# EAGLE design EX-YU_64K_C64_CART (EAGLE 6.3)
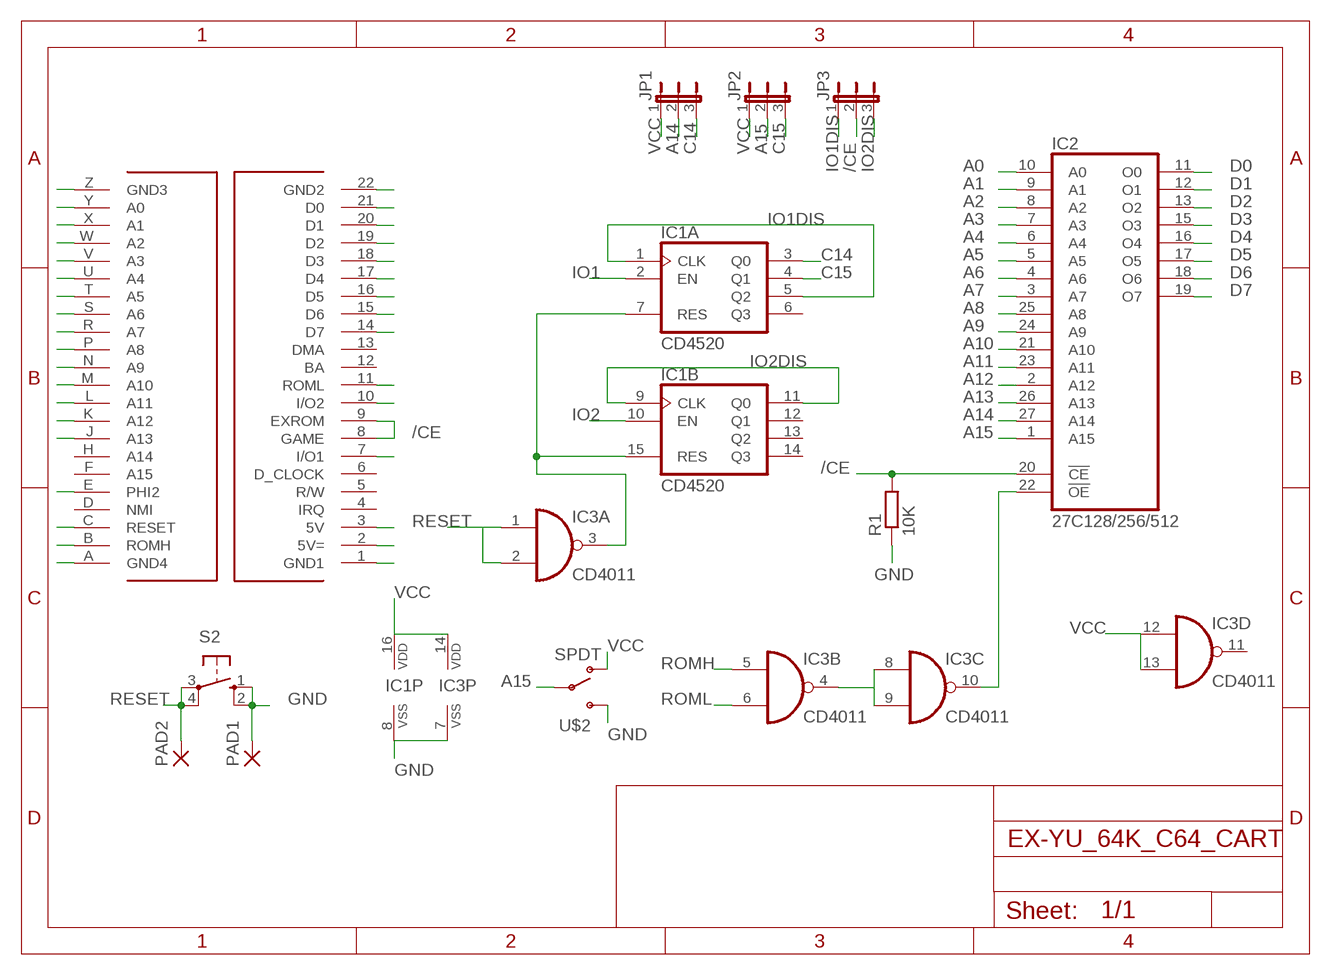
[diagram p0: schematic, sheet 1]

## Parts
IC1  CD4520  4520N  [DIL16]
IC2  27C128/256/512  27512  [DIL28]
IC3  CD4011  4011N  [DIL14]
JP1  JP2E  [JP2]
JP2  JP2E  [JP2]
JP3  JP2E  [JP2]
PAD1  SMD5  [SMD2,54-5,08]
PAD2  SMD5  [SMD2,54-5,08]
R1  10K  R-EU_0207/10  [0207/10]
S2  10-XX  [B3F-10XX]
U$1  C64_EXPANSION__CARTRIDGE  [C64_EXPANSION__CARTRIDGE]
U$2  SPDT  [SPDT-SLIDE]

## Nets
/CE: IC2.20(!CE) JP3.2 R1.2 U$1.8(GAME) U$1.9(EXROM)
A0: IC2.10(A0) U$1.Y(A0)
A1: IC2.9(A1) U$1.X(A1)
A2: IC2.8(A2) U$1.W(A2)
A3: IC2.7(A3) U$1.V(A3)
A4: IC2.6(A4) U$1.U(A4)
A5: IC2.5(A5) U$1.T(A5)
A6: IC2.4(A6) U$1.S(A6)
A7: IC2.3(A7) U$1.R(A7)
A8: IC2.25(A8) U$1.P(A8)
A9: IC2.24(A9) U$1.N(A9)
A10: IC2.21(A10) U$1.M(A10)
A11: IC2.23(A11) U$1.L(A11)
A12: IC2.2(A12) U$1.K(A12)
A13: IC2.26(A13) U$1.J(A13)
A14: IC2.27(A14) JP1.2
A15: IC2.1(A15) JP2.2 U$2.2
C14: IC1.3(A:Q0) JP1.3
C15: IC1.4(A:Q1) JP2.3
D0: IC2.11(O0) U$1.21(D0)
D1: IC2.12(O1) U$1.20(D1)
D2: IC2.13(O2) U$1.19(D2)
D3: IC2.15(O3) U$1.18(D3)
D4: IC2.16(O4) U$1.17(D4)
D5: IC2.17(O5) U$1.16(D5)
D6: IC2.18(O6) U$1.15(D6)
D7: IC2.19(O7) U$1.14(D7)
GND: IC1.8(P:VSS) IC3.7(P:VSS) PAD1.1(P) R1.1 S2.1(S) S2.2(S1) U$1.1(GND1) U$1.22(GND2) U$1.A(GND4) U$1.Z(GND3) U$2.3
IO1: IC1.2(A:EN) U$1.7(I/O1)
IO1DIS: IC1.1(A:CLK) IC1.5(A:Q2) JP3.1
IO2: IC1.10(B:EN) U$1.10(I/O2)
IO2DIS: IC1.9(B:CLK) IC1.11(B:Q0) JP3.3
N$2: IC1.7(A:RES) IC1.15(B:RES) IC3.3(A:O)
N$3: IC3.4(B:O) IC3.8(C:I0) IC3.9(C:I1)
N$4: IC2.22(!OE) IC3.10(C:O)
PHI2: U$1.E(PHI2)
RESET: IC3.1(A:I0) IC3.2(A:I1) PAD2.1(P) S2.3(P) S2.4(P1) U$1.C(RESET)
ROMH: IC3.5(B:I0) U$1.B(ROMH)
ROML: IC3.6(B:I1) U$1.11(ROML)
VCC: IC1.16(P:VDD) IC3.12(D:I0) IC3.13(D:I1) IC3.14(P:VDD) JP1.1 JP2.1 U$1.2(5V=) U$1.3(5V) U$2.1
Unconnected: IC1.6(A:Q3) IC1.12(B:Q1) IC1.13(B:Q2) IC1.14(B:Q3) IC3.11(D:O) U$1.4(IRQ) U$1.5(R/W) U$1.6(D_CLOCK) U$1.12(BA) U$1.13(DMA) U$1.D(NMI) U$1.F(A15) U$1.H(A14)

## Power pins joined to a net without a drawn wire
GND: IC2.14(GND)
VCC: IC2.28(VCC)

## Library data of the parts
IC1 = 45xx:4520: Dual binary up COUNTER
IC2 = memory:27512: MEMORY
IC3 = 40xx:4011: Quad 2-input NAND
JP1-JP3 = jumper:JP2E: JUMPER
PAD1 PAD2 = wirepad:SMD5: SMD PAD
R1 = resistor:R-EU_: RESISTOR, European symbol
S2 = switch-omron:10-XX: OMRON SWITCH; MPN: B3F-1000; OC_FARNELL: 176432; OC_NEWARK: 36M3542
U$1 = 64kb_cart-slim:C64_EXPANSION__CARTRIDGE
U$2 = switches:SPDT

## Board
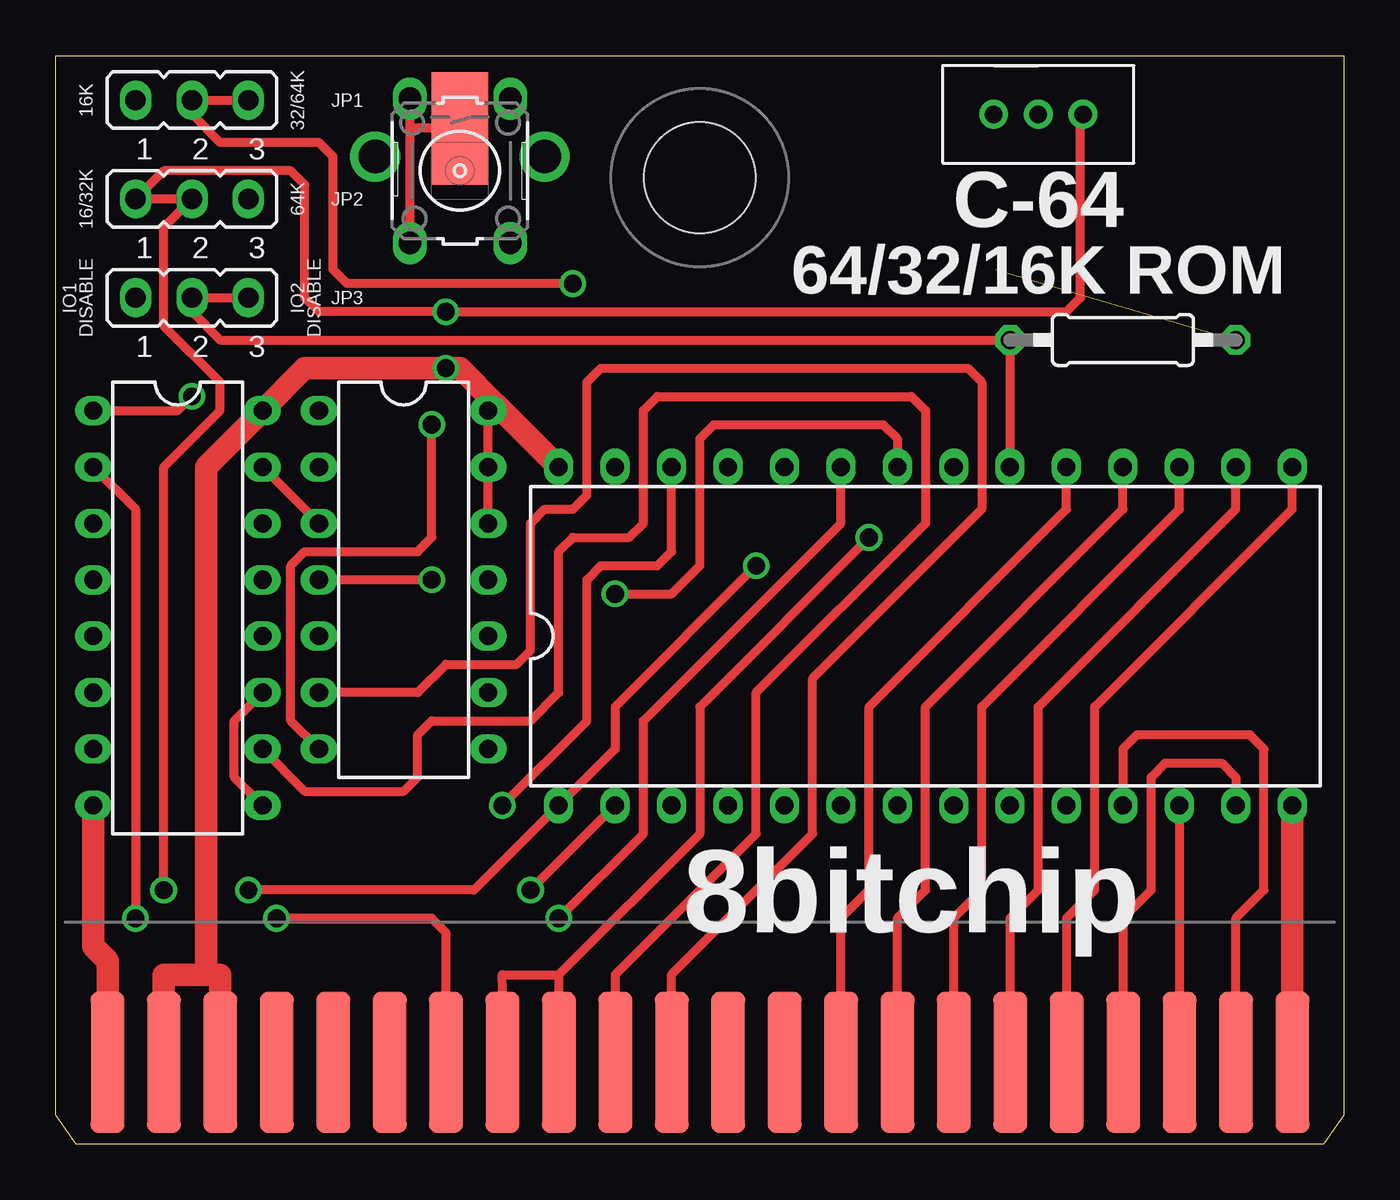
[diagram p1: board, top side]
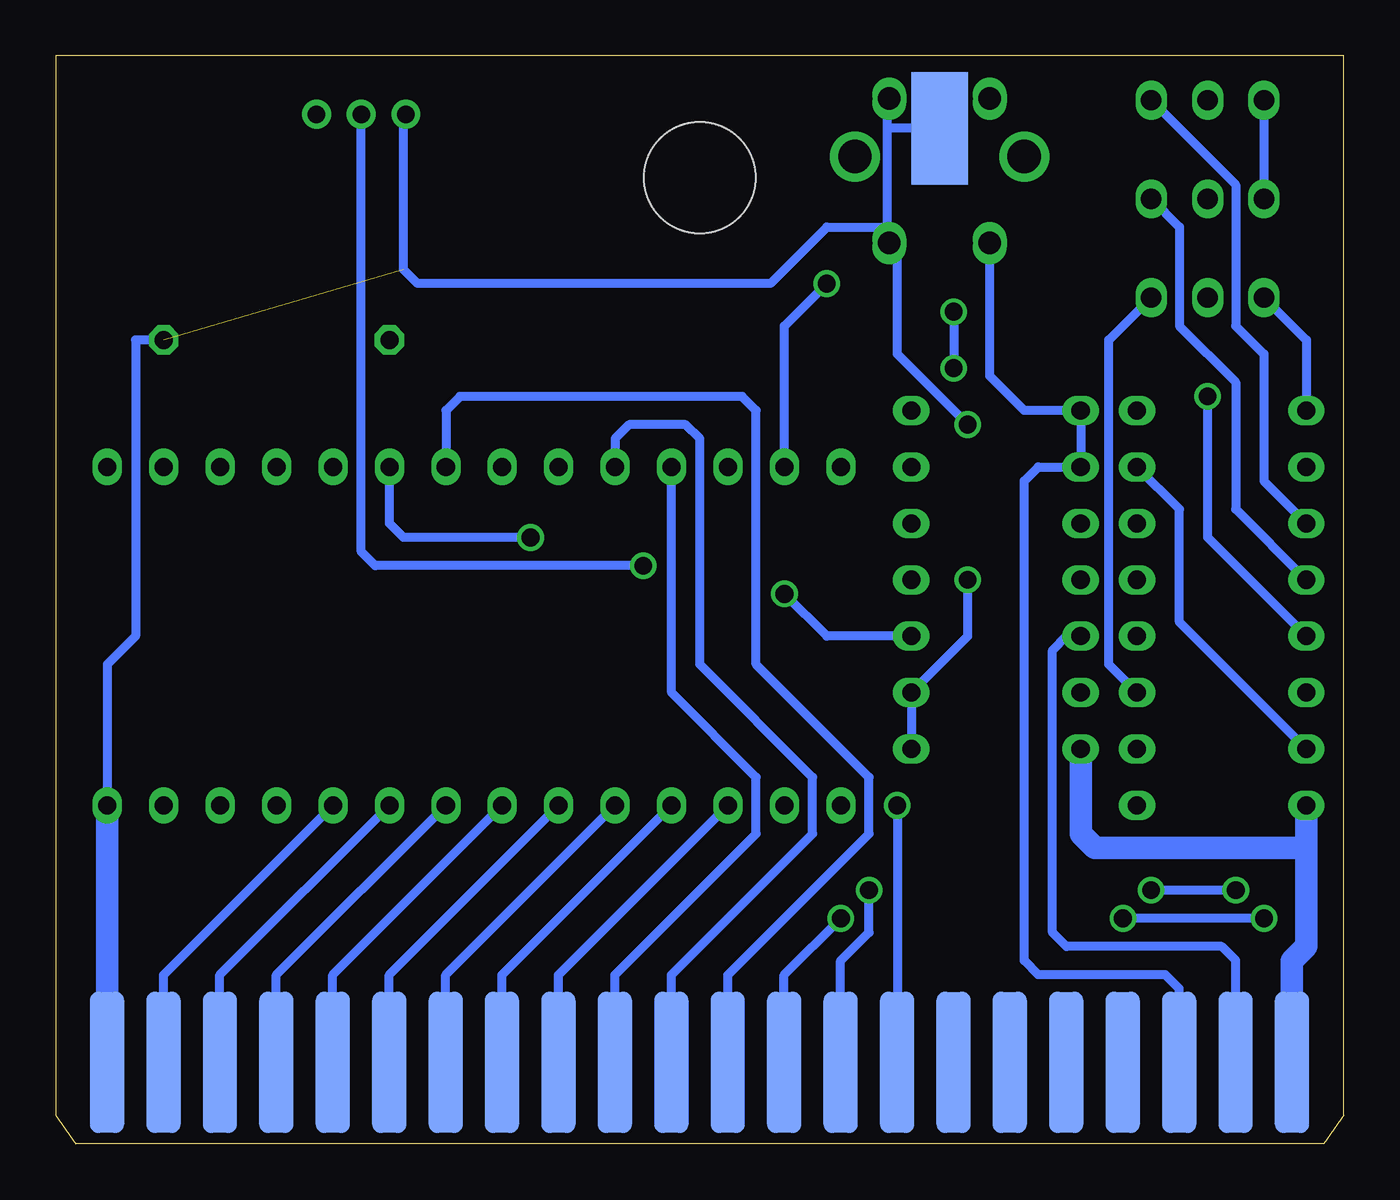
[diagram p2: board, bottom side, seen from below]

Size 58 x 49 mm. Coordinates in mm from the lower left corner, seen from the top.
Copper layers (1*16): Top 0.035mm / dielectric 1.5mm / Bottom 0.035mm
Design rules "dirt_cheap_dirty_boards.v1 *": minimum track width 5mil, minimum drill 12mil, track to track 5mil, track to pad 5mil, pad to pad 5mil, via to via 5mil, smd to smd 0mil, copper to edge 10mil, drill to drill 10mil, minimum pad ring 10mil, minimum via ring 6mil, stop-mask expansion 2mil, vias tented up to drill 25mil, thermal gap 10mil

### Footprints (pad centres in the part's own frame; a part is rotated, then mirrored left to right if it is on the bottom)
DIL16 = drill 0.813 long: 1 -8.89,-3.81; 2 -6.35,-3.81; 3 -3.81,-3.81; 4 -1.27,-3.81; 5 1.27,-3.81; 6 3.81,-3.81; 7 6.35,-3.81; 8 8.89,-3.81; 9 8.89,3.81; 10 6.35,3.81; 11 3.81,3.81; 12 1.27,3.81; 13 -1.27,3.81; 14 -3.81,3.81; 15 -6.35,3.81; 16 -8.89,3.81
DIL28 = drill 0.813 long: 1 -16.51,-7.62; 2 -13.97,-7.62; 3 -11.43,-7.62; 4 -8.89,-7.62; 5 -6.35,-7.62; 6 -3.81,-7.62; 7 -1.27,-7.62; 8 1.27,-7.62; 9 3.81,-7.62; 10 6.35,-7.62; 11 8.89,-7.62; 12 11.43,-7.62; 13 13.97,-7.62; 14 16.51,-7.62; 15 16.51,7.62; 16 13.97,7.62; 17 11.43,7.62; 18 8.89,7.62; 19 6.35,7.62; 20 3.81,7.62; 21 1.27,7.62; 22 -1.27,7.62; 23 -3.81,7.62; 24 -6.35,7.62; 25 -8.89,7.62; 26 -11.43,7.62; 27 -13.97,7.62; 28 -16.51,7.62
DIL14 = drill 0.813 long: 1 -7.62,-3.81; 2 -5.08,-3.81; 3 -2.54,-3.81; 4 0,-3.81; 5 2.54,-3.81; 6 5.08,-3.81; 7 7.62,-3.81; 8 7.62,3.81; 9 5.08,3.81; 10 2.54,3.81; 11 0,3.81; 12 -2.54,3.81; 13 -5.08,3.81; 14 -7.62,3.81
JP2 = drill 0.914 long: 1 -2.54,0; 2 0,0; 3 2.54,0
SMD2,54-5,08 = smd 2.54 x 5.08: 1 0,0
0207/10 = drill 0.813 octagon: 1 -5.08,0; 2 5.08,0
B3F-10XX = drill 1.016 long: 1 -3.251,2.261; 2 3.251,2.261; 3 -3.251,-2.261; 4 3.251,-2.261
C64_EXPANSION__CARTRIDGE = smd 1.524 x 6.35: 1 5.09,3.675; 2 7.63,3.675; 3 10.17,3.675; 4 12.71,3.675; 5 15.25,3.675; 6 17.79,3.675; 7 20.33,3.675; 8 22.87,3.675; 9 25.41,3.675; 10 27.95,3.675; 11 30.49,3.675; 12 33.03,3.675; 13 35.57,3.675; 14 38.11,3.675; 15 40.65,3.675; 16 43.19,3.675; 17 45.73,3.675; 18 48.27,3.675; 19 50.81,3.675; 20 53.35,3.675; 21 55.89,3.675; 22 58.43,3.675 | smd 1.524 x 6.35 bottom: A 5.09,3.675; B 7.63,3.675; C 10.17,3.675; D 12.71,3.675; E 15.25,3.675; F 17.79,3.675; H 20.33,3.675; J 22.87,3.675; K 25.41,3.675; L 27.95,3.675; M 30.49,3.675; N 33.03,3.675; P 35.57,3.675; R 38.11,3.675; S 40.65,3.675; T 43.19,3.675; U 45.73,3.675; V 48.27,3.675; W 50.81,3.675; X 53.35,3.675; Y 55.89,3.675; Z 58.43,3.675 | hole 5: 31.75,43.5
SPDT-SLIDE = drill 0.787: 1 -2.007,0; 2 0,0; 3 2.007,0

### Placement (x,y rotation side)
IC1  5.5,24.13 270 top
IC2  39.16,22.86 0 top
IC3  15.66,25.4 270 top
JP1  6.14,46.99 0 top
JP2  6.14,42.55 0 top
JP3  6.14,38.1 0 top
PAD1  18.2,45.72 0 bottom
PAD2  18.2,45.72 0 top
R1  48.05,36.2 180 top
S2  18.2,43.81 270 top
U$1  -2.75,0 0 top
U$2  44.24,46.35 180 top

### Tracks (layer width: path | path; a pad name or v marks a point on that pad's centre or on a via)
/CE  (via drill 0.8)
  Top 0.406: U$1.8 20.12,6.97 20.11,7.62 22.65,7.62 | 22.65,7.62 22.65,3.69 U$1.9 | v36.62,27.3 29,19.68 29,13.97 22.65,7.62 | IC2.20 R1.2 7.41,36.2 6.14,37.47 JP3.2
  Bottom 0.406: v36.62,27.3 42.34,27.3 42.97,27.94 IC2.20
A0
  Bottom 0.406: U$1.Y 53.14,7.61 IC2.10
A1
  Bottom 0.406: U$1.X 50.6,7.61 IC2.9
A2
  Bottom 0.406: U$1.W 48.06,7.61 IC2.8
A3
  Bottom 0.406: U$1.V 45.52,7.61 IC2.7
A4
  Bottom 0.406: U$1.U 42.98,7.61 IC2.6
A5
  Bottom 0.406: U$1.T 40.44,7.61 IC2.5
A6
  Bottom 0.406: U$1.S 37.9,7.61 IC2.4
A7
  Bottom 0.406: U$1.R 35.36,7.61 IC2.3
A8
  Bottom 0.406: U$1.P 32.82,7.61 26.46,13.97 26.46,16.51 30.27,20.32 IC2.25
A9
  Bottom 0.406: U$1.N 30.28,7.61 23.92,13.97 23.92,16.51 29,21.59 29,31.75 29.63,32.38 32.17,32.38 32.81,31.75 IC2.24
A10
  Bottom 0.406: U$1.M 27.74,7.61 21.38,13.97 21.38,16.51 26.46,21.59 26.46,33.02 27.09,33.66 39.8,33.66 40.43,33.02 IC2.21
A11  (via drill 0.8)
  Top 0.406: v22.65,10.16 26.46,13.97 26.46,19.05 35.35,27.94 IC2.23
  Bottom 0.406: U$1.L 25.2,7.61 v22.65,10.16
A12  (via drill 0.8)
  Top 0.406: IC2.2 v21.38,11.43
  Bottom 0.406: 22.65,3.69 U$1.K 22.66,8.24 21.38,9.53 v21.38,11.43
A13  (via drill 0.8)
  Top 0.406: v20.11,15.24 23.92,19.05 23.92,25.4 24.55,26.04 27.09,26.04 27.73,26.67 IC2.26
  Bottom 0.406: v20.11,15.24 20.11,3.69 U$1.J
A14  (via drill 0.8)
  Top 0.406: v23.29,38.73 13.12,38.73 12.49,39.37 12.49,44.45 11.86,45.09 7.41,45.09 6.14,46.35 JP1.2
  Bottom 0.406: IC2.27 25.19,36.83 v23.29,38.73
A15  (via drill 0.8)
  Top 0.406: v8.68,11.43 18.84,11.43 IC2.1 25.19,17.78 25.19,19.68 v31.54,26.04 | JP2.2 4.87,41.27 4.87,36.83 7.41,34.29 7.41,33.02 4.87,30.48 v4.87,11.43
  Bottom 0.406: v8.68,11.43 v4.87,11.43 | v31.54,26.04 43.6,26.04 44.24,26.67 U$2.2
C14
  Bottom 0.406: JP1.3 4.87,43.18 4.87,36.83 3.6,35.56 3.6,29.84 IC1.3
C15
  Bottom 0.406: JP2.3 7.41,41.27 7.41,36.83 4.87,34.29 4.87,28.57 IC1.4
D0
  Top 0.406: U$1.21 53.14,10.17 54.4,11.43 54.4,17.78 53.77,18.41 48.69,18.41 48.05,17.78 IC2.11
D1
  Top 0.406: U$1.20 IC2.12
D2
  Top 0.406: U$1.19 48.06,10.17 49.32,11.43 49.32,16.51 49.95,17.14 52.49,17.14 53.13,16.51 IC2.13
D3
  Top 0.406: U$1.18 45.52,10.17 46.78,11.43 46.78,19.68 55.67,28.57 IC2.15
D4
  Top 0.406: U$1.17 42.98,10.17 44.24,11.43 44.24,19.68 53.13,28.57 IC2.16
D5
  Top 0.406: U$1.16 40.44,10.17 41.7,11.43 41.7,19.68 50.59,28.57 IC2.17
D6
  Top 0.406: U$1.15 37.9,10.17 39.16,11.43 39.16,19.68 48.05,28.57 IC2.18
D7
  Top 0.406: U$1.14 35.36,10.17 36.62,11.43 36.62,19.68 45.51,28.57 IC2.19
GND  (via drill 0.8)  (1 unrouted)
  Top 0.406: IC3.7 10.59,19.05 10.59,26.04 11.22,26.67 16.3,26.67 16.93,27.3 v16.93,32.38
  Top 0.813: IC2.14
  Top 1.016: U$1.Z IC2.14 | U$1.A 2.34,8.24 1.7,8.89 IC1.8
  Bottom 0.406: R1.1 54.4,36.2 54.4,22.86 55.67,21.59 IC2.14 | v16.93,32.38 20.11,35.56 20.11,40.84 S2.2 20.54,41.27 | 20.54,41.27 20.54,45.72 | 20.54,45.72 20.54,47.62 S2.1 | PAD1.1 20.54,45.72 | 20.54,41.27 23.29,41.27 25.82,38.73 41.7,38.73 42.34,39.37 42.34,46.25 U$2.3
  Bottom 0.813: IC2.14
  Bottom 1.016: U$1.Z IC2.14 | IC3.7 11.86,13.97 11.22,13.34 1.7,13.34 | 1.7,13.34 IC1.8 | U$1.A 2.34,8.24 1.7,8.89 1.7,13.34
IO1  (via drill 0.8)
  Top 0.406: U$1.7 17.58,9.52 16.93,10.16 v9.95,10.16 | IC1.2 3.6,28.57 v3.6,10.16
  Bottom 0.406: v3.6,10.16 v9.95,10.16
IO1DIS  (via drill 0.8)
  Top 0.406: IC1.1 5.5,33.02 v6.14,33.66
  Bottom 0.406: JP3.1 1.7,36.2 IC1.1 | IC1.5 6.14,27.3 v6.14,33.66
IO2
  Top 0.406: U$1.10 25.2,7.63 31.54,13.97 31.54,20.32 39.16,27.94 39.16,33.02 38.52,33.66 27.09,33.66 26.46,33.02 26.46,27.94 25.82,27.3 23.29,27.3 22.65,26.67 22.65,20.32 21.38,19.05 16.93,19.05 16.3,18.41 16.3,16.51 15.66,15.88 11.22,15.88 IC1.10
IO2DIS
  Top 0.406: IC1.9 8.05,16.51 8.05,19.05 IC1.11
  Bottom 0.406: IC1.11 10.59,21.59 10.59,36.2 JP3.3
N$1
  Top 0.406: 6.14,46.99 8.68,46.99
N$2
  Top 0.406: IC1.15 IC3.3
  Bottom 0.406: IC1.7 7.41,23.5 7.41,28.57 IC1.15
N$3  (via drill 0.8)
  Top 0.406: v16.93,25.4 IC3.4
  Bottom 0.406: IC3.8 IC3.9 16.93,22.86 v16.93,25.4
N$4  (via drill 0.8)
  Top 0.406: v25.19,24.77 27.73,24.77 29,26.04 29,31.75 29.63,32.38 37.26,32.38 37.89,31.75 IC2.22
  Bottom 0.406: IC3.10 23.29,22.86 v25.19,24.77
N$5
  Top 0.406: 3.6,42.55 6.14,42.55
N$6
  Top 0.406: 6.14,38.1 8.68,38.1
N$7  (via drill 1.5)
  other vias: 14.39,44.45
N$8  (via drill 1.5)
  other vias: 22.02,44.45
RESET
  Top 0.406: S2.3 15.94,45.72 | 15.94,45.72 S2.4 | PAD2.1 15.94,45.72
  Bottom 0.406: S2.4 15.94,34.57 14.39,33.02 IC3.1 IC3.2 13.76,30.48 14.39,29.84 14.39,8.26 13.76,7.62 8.05,7.62 7.42,7 U$1.C
ROMH
  Bottom 0.406: U$1.B 4.88,8.27 5.5,8.89 12.49,8.89 13.12,9.53 13.12,22.23 12.49,22.86 IC3.5
ROML
  Top 0.406: U$1.11 27.74,7.63 34.08,13.97 34.08,20.95 41.7,28.57 41.7,34.29 41.06,34.92 24.55,34.92 23.92,34.29 23.92,29.21 23.29,28.57 22.02,28.57 21.38,27.94 21.38,22.23 20.74,21.59 17.57,21.59 16.3,20.32 IC3.6
VCC  (via drill 0.8)
  Top 0.406: U$2.1 46.14,46.25 46.14,38.1 45.51,37.47 v17.57,37.47 11.86,37.47 11.22,38.1 11.22,43.18 10.59,43.81 4.87,43.81 JP2.1 | IC3.12 IC3.13 IC3.14
  Top 1.016: 6.78,7.62 6.78,30.48 IC1.16 11.22,34.92 v17.57,34.92 18.2,34.92 19.79,33.34 | U$1.2 4.87,3.69 4.87,7.62 6.78,7.62 | U$1.3 7.42,7.61 7.41,7.62 6.78,7.62 | 19.79,33.34 IC2.28 | IC3.14 19.79,33.34
  Bottom 0.406: JP1.1 JP2.1 | v17.57,37.47 v17.57,34.92

### Text on the board
tNames: 16K | 32/64K | 16/32K | 64K | C-64 | 64/32/16K ROM | IO1 / DISABLE | IO2 / DISABLE | 8bitchip